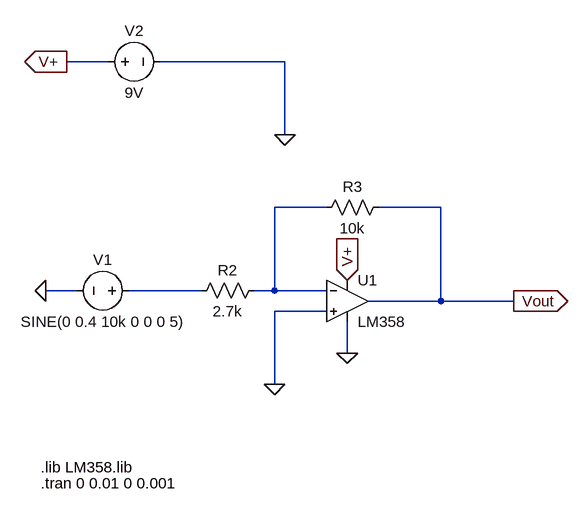
[diagram p0: schematic ssc-vsc-simulation.asc]
ssc-vsc-simulation.asc, the LTspice schematic file:
Version 4
SHEET 1 880 724
WIRE -416 -336 -480 -336
WIRE -144 -336 -336 -336
WIRE -144 -224 -144 -336
WIRE -80 -112 -160 -112
WIRE 96 -112 0 -112
WIRE -464 16 -512 16
WIRE -272 16 -384 16
WIRE -160 16 -160 -112
WIRE -160 16 -192 16
WIRE -80 16 -160 16
WIRE 96 32 96 -112
WIRE 96 32 -16 32
WIRE 208 32 96 32
WIRE -80 48 -160 48
WIRE -48 112 -48 64
WIRE -160 160 -160 48
FLAG 208 32 Vout
IOPIN 208 32 Out
FLAG -512 16 0
FLAG -160 160 0
FLAG -144 -224 0
FLAG -480 -336 V+
IOPIN -480 -336 Out
FLAG -48 0 V+
IOPIN -48 0 In
FLAG -48 112 0
SYMBOL OpAmps\\opamp2 -48 -32 R0
SYMATTR InstName U1
SYMATTR Value LM358
SYMBOL res -288 32 R270
WINDOW 0 32 56 VTop 2
WINDOW 3 0 56 VBottom 2
SYMATTR InstName R2
SYMATTR Value 2.7k
SYMBOL res -96 -96 R270
WINDOW 0 32 56 VTop 2
WINDOW 3 0 56 VBottom 2
SYMATTR InstName R3
SYMATTR Value 10k
SYMBOL voltage -368 16 R90
WINDOW 0 -32 56 VBottom 2
WINDOW 3 32 56 VTop 2
WINDOW 123 0 0 Left 0
WINDOW 39 0 0 Left 0
SYMATTR InstName V1
SYMATTR Value SINE(0 0.4 10k 0 0 0 5)
SYMBOL voltage -432 -336 R270
WINDOW 0 32 56 VTop 2
WINDOW 3 -32 56 VBottom 2
SYMATTR InstName V2
SYMATTR Value 9V
TEXT -520 288 Left 2 !.lib LM358.lib
TEXT -520 312 Left 2 !.tran 0 0.01 0 0.001

The netlist it stands for:
* ssc-vsc-simulation.asc
XU1 0 N001 V+ 0 Vout LM358  ; pins In+ In- V+ V- OUT
R2 N002 N001 2.7k
R3 N001 Vout 10k
V1 N002 0 SINE(0 0.4 10k 0 0 0 5)
V2 V+ 0 9V
.lib LM358.lib
.tran 0 0.01 0 0.001
.backanno
.end